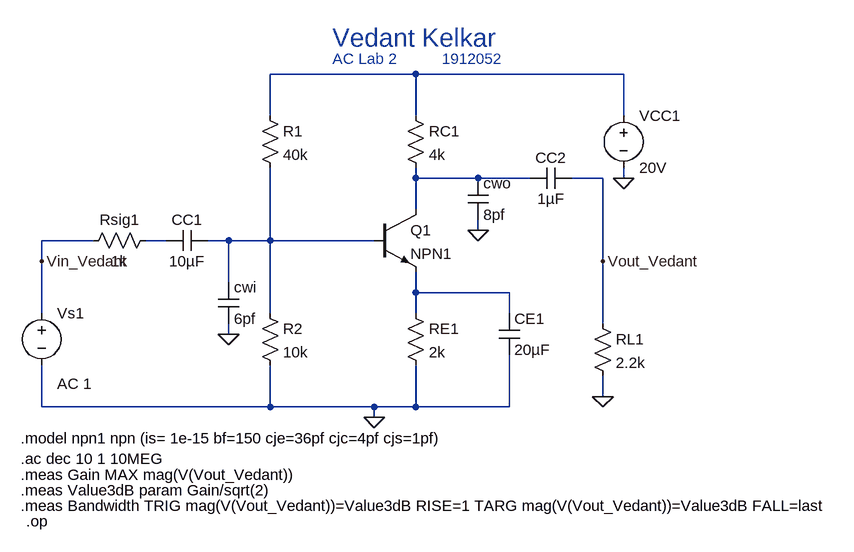
[diagram p0: schematic AC2_lab2.asc]
AC2_lab2.asc, the LTspice schematic file:
Version 4
SHEET 1 924 848
WIRE 192 144 -32 144
WIRE 512 144 192 144
WIRE -32 208 -32 144
WIRE 192 208 192 144
WIRE 512 208 512 144
WIRE 192 304 192 288
WIRE 288 304 192 304
WIRE 368 304 288 304
WIRE 480 304 432 304
WIRE 512 304 512 288
WIRE 192 352 192 304
WIRE 288 384 288 368
WIRE -304 400 -384 400
WIRE -192 400 -224 400
WIRE -96 400 -128 400
WIRE -32 400 -32 288
WIRE -32 400 -96 400
WIRE 128 400 -32 400
WIRE -384 432 -384 400
WIRE 480 432 480 304
WIRE -96 464 -96 400
WIRE 192 480 192 448
WIRE 336 480 192 480
WIRE -384 512 -384 432
WIRE -32 512 -32 400
WIRE 192 512 192 480
WIRE 336 512 336 480
WIRE 480 528 480 432
WIRE -96 544 -96 528
WIRE 480 640 480 608
WIRE -384 656 -384 592
WIRE -32 656 -32 592
WIRE -32 656 -384 656
WIRE 128 656 -32 656
WIRE 192 656 192 592
WIRE 192 656 128 656
WIRE 336 656 336 576
WIRE 336 656 192 656
WIRE 128 672 128 656
FLAG 480 640 0
FLAG 512 304 0
FLAG 128 672 0
FLAG -384 432 Vin_Vedant
FLAG 288 384 0
FLAG -96 544 0
FLAG 480 432 Vout_Vedant
SYMBOL res -48 192 R0
SYMATTR InstName R1
SYMATTR Value 40k
SYMBOL res 176 192 R0
SYMATTR InstName RC1
SYMATTR Value 4k
SYMBOL res 176 496 R0
SYMATTR InstName RE1
SYMATTR Value 2k
SYMBOL res -48 496 R0
SYMATTR InstName R2
SYMATTR Value 10k
SYMBOL npn 128 352 R0
SYMATTR InstName Q1
SYMATTR Value NPN1
SYMBOL res -208 384 R90
WINDOW 0 0 56 VBottom 2
WINDOW 3 32 56 VTop 2
SYMATTR InstName Rsig1
SYMATTR Value 1k
SYMBOL voltage -384 496 R0
WINDOW 123 24 124 Left 2
WINDOW 39 0 0 Left 0
SYMATTR Value2 AC 1
SYMATTR InstName Vs1
SYMATTR Value ""
SYMBOL res 464 512 R0
SYMATTR InstName RL1
SYMATTR Value 2.2k
SYMBOL cap 320 512 R0
SYMATTR InstName CE1
SYMATTR Value 20µF
SYMBOL voltage 512 192 R0
SYMATTR InstName VCC1
SYMATTR Value 20V
SYMBOL cap 432 288 R90
WINDOW 0 0 32 VBottom 2
WINDOW 3 32 32 VTop 2
SYMATTR InstName CC2
SYMATTR Value 1µF
SYMBOL cap 272 304 R0
SYMATTR InstName cwo
SYMATTR Value 8pf
SYMBOL cap -112 464 R0
SYMATTR InstName cwi
SYMATTR Value 6pf
SYMBOL cap -128 384 R90
WINDOW 0 0 32 VBottom 2
WINDOW 3 32 32 VTop 2
SYMATTR InstName CC1
SYMATTR Value 10µF
TEXT 64 88 Left 4 ;Vedant Kelkar
TEXT 64 120 Left 2 ;AC Lab 2          1912052
TEXT -416 704 Left 2 !.model npn1 npn (is= 1e-15 bf=150 cje=36pf cjc=4pf cjs=1pf)
TEXT -416 736 Left 2 !.ac dec 10 1 10MEG
TEXT -416 760 Left 2 !.meas Gain MAX mag(V(Vout_Vedant))
TEXT -416 784 Left 2 !.meas Value3dB param Gain/sqrt(2)
TEXT -416 808 Left 2 !.meas Bandwidth TRIG mag(V(Vout_Vedant))=Value3dB RISE=1 TARG mag(V(Vout_Vedant))=Value3dB FALL=last
TEXT -408 832 Left 2 !.op

The netlist it stands for:
* AC2_lab2.asc
R1 N001 N004 40k
RC1 N001 N002 4k
RE1 N005 0 2k
R2 N004 0 10k
Q1 N002 N004 N005 0 NPN1
Rsig1 N003 Vin_Vedant 1k
Vs1 Vin_Vedant 0 AC 1
RL1 Vout_Vedant 0 2.2k
CE1 N005 0 20µF
VCC1 N001 0 20V
CC2 Vout_Vedant N002 1µF
cwo N002 0 8pf
cwi N004 0 6pf
CC1 N004 N003 10µF
.model NPN NPN
.model PNP PNP
.lib standard.bjt
* Vedant Kelkar
* AC Lab 2          1912052
.model npn1 npn (is= 1e-15 bf=150 cje=36pf cjc=4pf cjs=1pf)
.ac dec 10 1 10MEG
.meas Gain MAX mag(V(Vout_Vedant))
.meas Value3dB param Gain/sqrt(2)
.meas Bandwidth TRIG mag(V(Vout_Vedant))=Value3dB RISE=1 TARG mag(V(Vout_Vedant))=Value3dB FALL=last
.op
.backanno
.end